# EAGLE schematic Retro-Lite-Dock-PCB-Front (EAGLE 9.6.2)
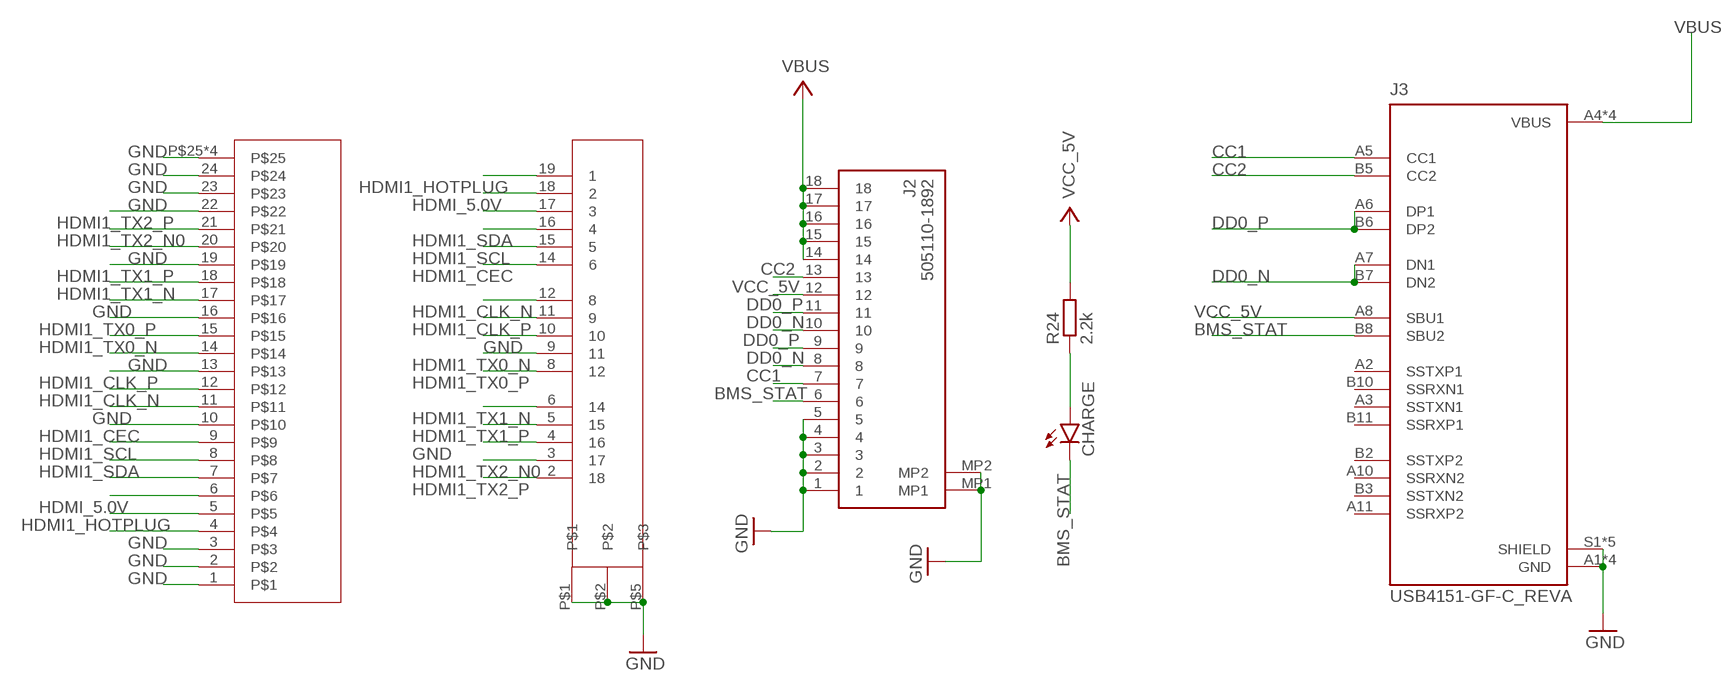
[diagram p0: schematic, sheet 1]

## Parts
CHARGE  LEDSML0603  [SML0603]
J2  505110-1892  [5051101892]
J3  USB4151-GF-C_REVA  [GCT_USB4151-GF-C_REVA]
R24  2.2k  R-EU_R0603  [R0603]
U$1  60S019P-301N-B1-FEC  [60S019P-301N-B1-FEC]
U$2  5022442430_FFC  [5022442430]

## Nets
BMS_STAT: CHARGE.C J2.6 J3.B8(SBU2)
CC1: J2.7 J3.A5(CC1)
CC2: J2.13 J3.B5(CC2)
DD0_N [USB2.0]: J2.8 J2.10 J3.A7(DN1) J3.B7(DN2)
DD0_P [USB2.0]: J2.9 J2.11 J3.A6(DP1) J3.B6(DP2)
GND: J2.1 J2.2 J2.3 J2.4 J2.5 J2.MP1 J2.MP2 J3.A1(GND) J3.A12(GND) J3.B1(GND) J3.B12(GND) J3.S1(SHIELD) J3.S2(SHIELD) J3.S3(SHIELD) J3.S4(SHIELD) J3.S5(SHIELD) U$1.4 U$1.10 U$1.P$1 U$1.P$2 U$1.P$5 U$2.1 U$2.2 U$2.3 U$2.10 U$2.13 U$2.16 U$2.19 U$2.22 U$2.23 U$2.24 U$2.P$25 U$2.P$26 U$2.P$27 U$2.P$28
HDMI1_CEC: U$1.14 U$2.9
HDMI1_CLK_N [HDMI 2.0]: U$1.12 U$2.11
HDMI1_CLK_P [HDMI 2.0]: U$1.11 U$2.12
HDMI1_HOTPLUG: U$1.19 U$2.4
HDMI1_SCL: U$1.15 U$2.8
HDMI1_SDA: U$1.16 U$2.7
HDMI1_TX0_N [HDMI 2.0]: U$1.9 U$2.14
HDMI1_TX0_P [HDMI 2.0]: U$1.8 U$2.15
HDMI1_TX1_N [HDMI 2.0]: U$1.6 U$2.17
HDMI1_TX1_P [HDMI 2.0]: U$1.5 U$2.18
HDMI1_TX2_N0 [HDMI 2.0]: U$1.3 U$2.20
HDMI1_TX2_P [HDMI 2.0]: U$1.2 U$2.21
HDMI_5.0V: U$1.18 U$2.5
N$2: CHARGE.A R24.1
N$10: U$2.6
N$17: U$1.17
VBUS: J2.14 J2.15 J2.16 J2.17 J2.18 J3.A4(VBUS) J3.A9(VBUS) J3.B4(VBUS) J3.B9(VBUS) ; supply symbol labelled VCC
VCC_5V: J2.12 J3.A8(SBU1) R24.2 ; supply symbol labelled VCC
Unconnected: J3.A2(SSTXP1) J3.A3(SSTXN1) J3.A10(SSRXN2) J3.A11(SSRXP2) J3.B2(SSTXP2) J3.B3(SSTXN2) J3.B10(SSRXN1) J3.B11(SSRXP1)

## Notes on the sheet
- VCC_5V

## Library data of the parts
CHARGE = led:LED: LED OSRAM: - CHIPLED LG R971, LG N971, LY N971, LG Q971, LY Q971, LO R971, LY R971 LH N974, LH R974 LS Q976, LO Q976, LY Q976 LO Q996 - Hyper CHIPLED LW Q18S LB Q993, LB Q99A, LB R99A - SideLED LS A670, LO A670, LY A670, LG A670, LP A670 LB A673, LV A673, LT A673, LW A673 LH A674 LY A675 LS A676, LA A676, LO A676, LY A676, LW A676 LS A679, LY A679, LG A679 - Hyper Micro SIDELED® LS Y876, LA Y876, LO Y876, LY Y876 LT Y87S - SmartLED LW L88C, LW L88S LB L89C, LB L89S, LG L890 LS L89K, LO L89K, LY L89K LS L896, LA L896, LO L896, LY L896 - TOPLED LS T670, LO T670, LY T670, LG T670, LP T670 LSG T670, LSP T670, LSY T670, LOP T670, LYG T670 LG T671, LOG T671, LSG T671 LB T673, LV T673, LT T673, LW T673 LH T674 LS T676, LA T676, LO T676, LY T676, LB T676, LH T676, LSB T676, LW T676 LB T67C, LV T67C, LT T67C, LS T67K, LO T67K, LY T67K, LW E67C LS E67B, LA E67B, LO E67B, LY E67B, LB E67C, LV E67C, LT E67C LW T67C LS T679, LY T679, LG T679 LS T770, LO T770, LY T770, LG T770, LP T770 LB T773, LV T773, LT T773, LW T773 LH T774 LS E675, LA E675, LY E675, LS T675 LS T776, LA T776, LO T776, LY T776, LB T776 LHGB T686 LT T68C, LB T68C - Hyper Mini TOPLED® LB M676 - Mini TOPLED Santana® LG M470 LS M47K, LO M47K, LY M47K Source: http://www.osram.convergy.de LUXEON: - LUMILED® LXK2-PW12-R00, LXK2-PW12-S00, LXK2-PW14-U00, LXK2-PW14-V00 LXK2-PM12-R00, LXK2-PM12-S00, LXK2-PM14-U00 LXK2-PE12-Q00, LXK2-PE12-R00, LXK2-PE12-S00, LXK2-PE14-T00, LXK2-PE14-U00 LXK2-PB12-K00, LXK2-PB12-L00, LXK2-PB12-M00, LXK2-PB14-N00, LXK2-PB14-P00, LXK2-PB14-Q00 LXK2-PR12-L00, LXK2-PR12-M00, LXK2-PR14-Q00, LXK2-PR14-R00 LXK2-PD12-Q00, LXK2-PD12-R00, LXK2-PD12-S00 LXK2-PH12-R00, LXK2-PH12-S00 LXK2-PL12-P00, LXK2-PL12-Q00, LXK2-PL12-R00 Source: www.luxeon.com KINGBRIGHT: KA-3528ASYC Source: www.kingbright.com
J2 = 505110-1892:505110-1892: Molex Easy-On Series 0.5mm Pitch 18 Way Right Angle SMT Male FPC Connector, ZIF Bottom Contact Source: Datasheet <https://componentsearchengine.com/Datasheets/2/505110-1892.pdf>; DESCRIPTION: Molex Easy-On Series 0.5mm Pitch 18 Way Right Angle SMT Male FPC Connector, ZIF Bottom Contact; HEIGHT: 2.1mm; MANUFACTURER_NAME: Molex; MANUFACTURER_PART_NUMBER: 505110-1892; MOUSER_PART_NUMBER: 538-505110-1892; MOUSER_PRICE-STOCK: https://www.mouser.com/Search/Refine.aspx?Keyword=538-505110-1892
J3 = USB4151-GF-C_REVA:USB4151-GF-C_REVA: USB Type C Plug, Vertical, SMT Check availability <https://pricing.snapeda.com/parts/USB4151-GF-C/Global%20Connector%20Technology/view-part?ref=eda>; AVAILABILITY: In Stock; DESCRIPTION: USB Type C 3.1 vertical surface mount connector, 11.10mm profile, 24 Pins, Through hole; MF: Global Connector Technology; MP: USB4151-GF-C; PACKAGE: None; PRICE: None; PURCHASE-URL: https://pricing.snapeda.com/search/part/USB4151-GF-C/?ref=eda
R24 = rcl:R-EU_: RESISTOR, European symbol; SPICEPREFIX: R
U$1 = 60S019P-301N-B1-FEC:60S019P-301N-B1-FEC
U$2 = 5022442430:5022442430_FFC

## Net classes
1 USB2.0: width 0.192 mm, clearance 0.114 mm
2 HDMI 2.0: width 0.126 mm, clearance 0.102 mm